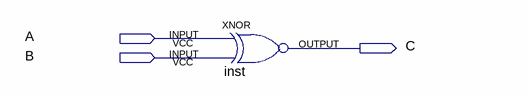
[diagram p0: schematic sheet]
// Quartus schematic XNOR_VHDL.bdf as structural Verilog: 1 symbols, 3 pins
module XNOR_VHDL (
  input  A,
  input  B,
  output C
);

  xnor inst (C, A, B);
endmodule
